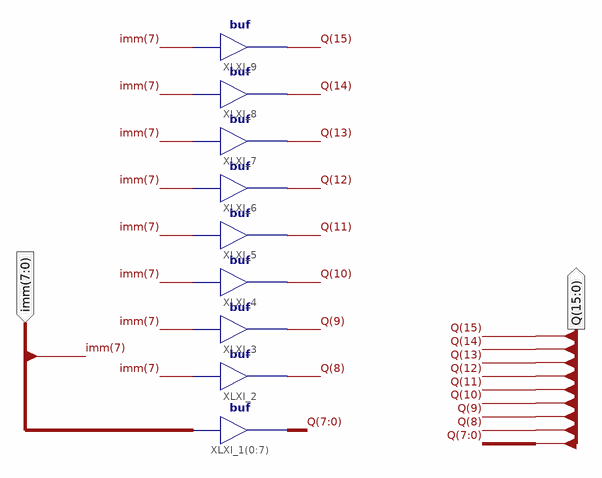
[diagram p0: schematic sheet 1]
// Xilinx ISE schematic sign_extend_8_16.sch (virtex6) as structural Verilog: 9 symbols, 2 ports
module sign_extend_8_16 (
  input  [7:0] imm,
  output [15:0] Q
);

  assign Q[7:0] = imm;  // buf XLXI_1[0..7], 8 bits wide
  buf XLXI_2 (Q[8], imm[7]);
  buf XLXI_3 (Q[9], imm[7]);
  buf XLXI_4 (Q[10], imm[7]);
  buf XLXI_5 (Q[11], imm[7]);
  buf XLXI_6 (Q[12], imm[7]);
  buf XLXI_7 (Q[13], imm[7]);
  buf XLXI_8 (Q[14], imm[7]);
  buf XLXI_9 (Q[15], imm[7]);
endmodule
